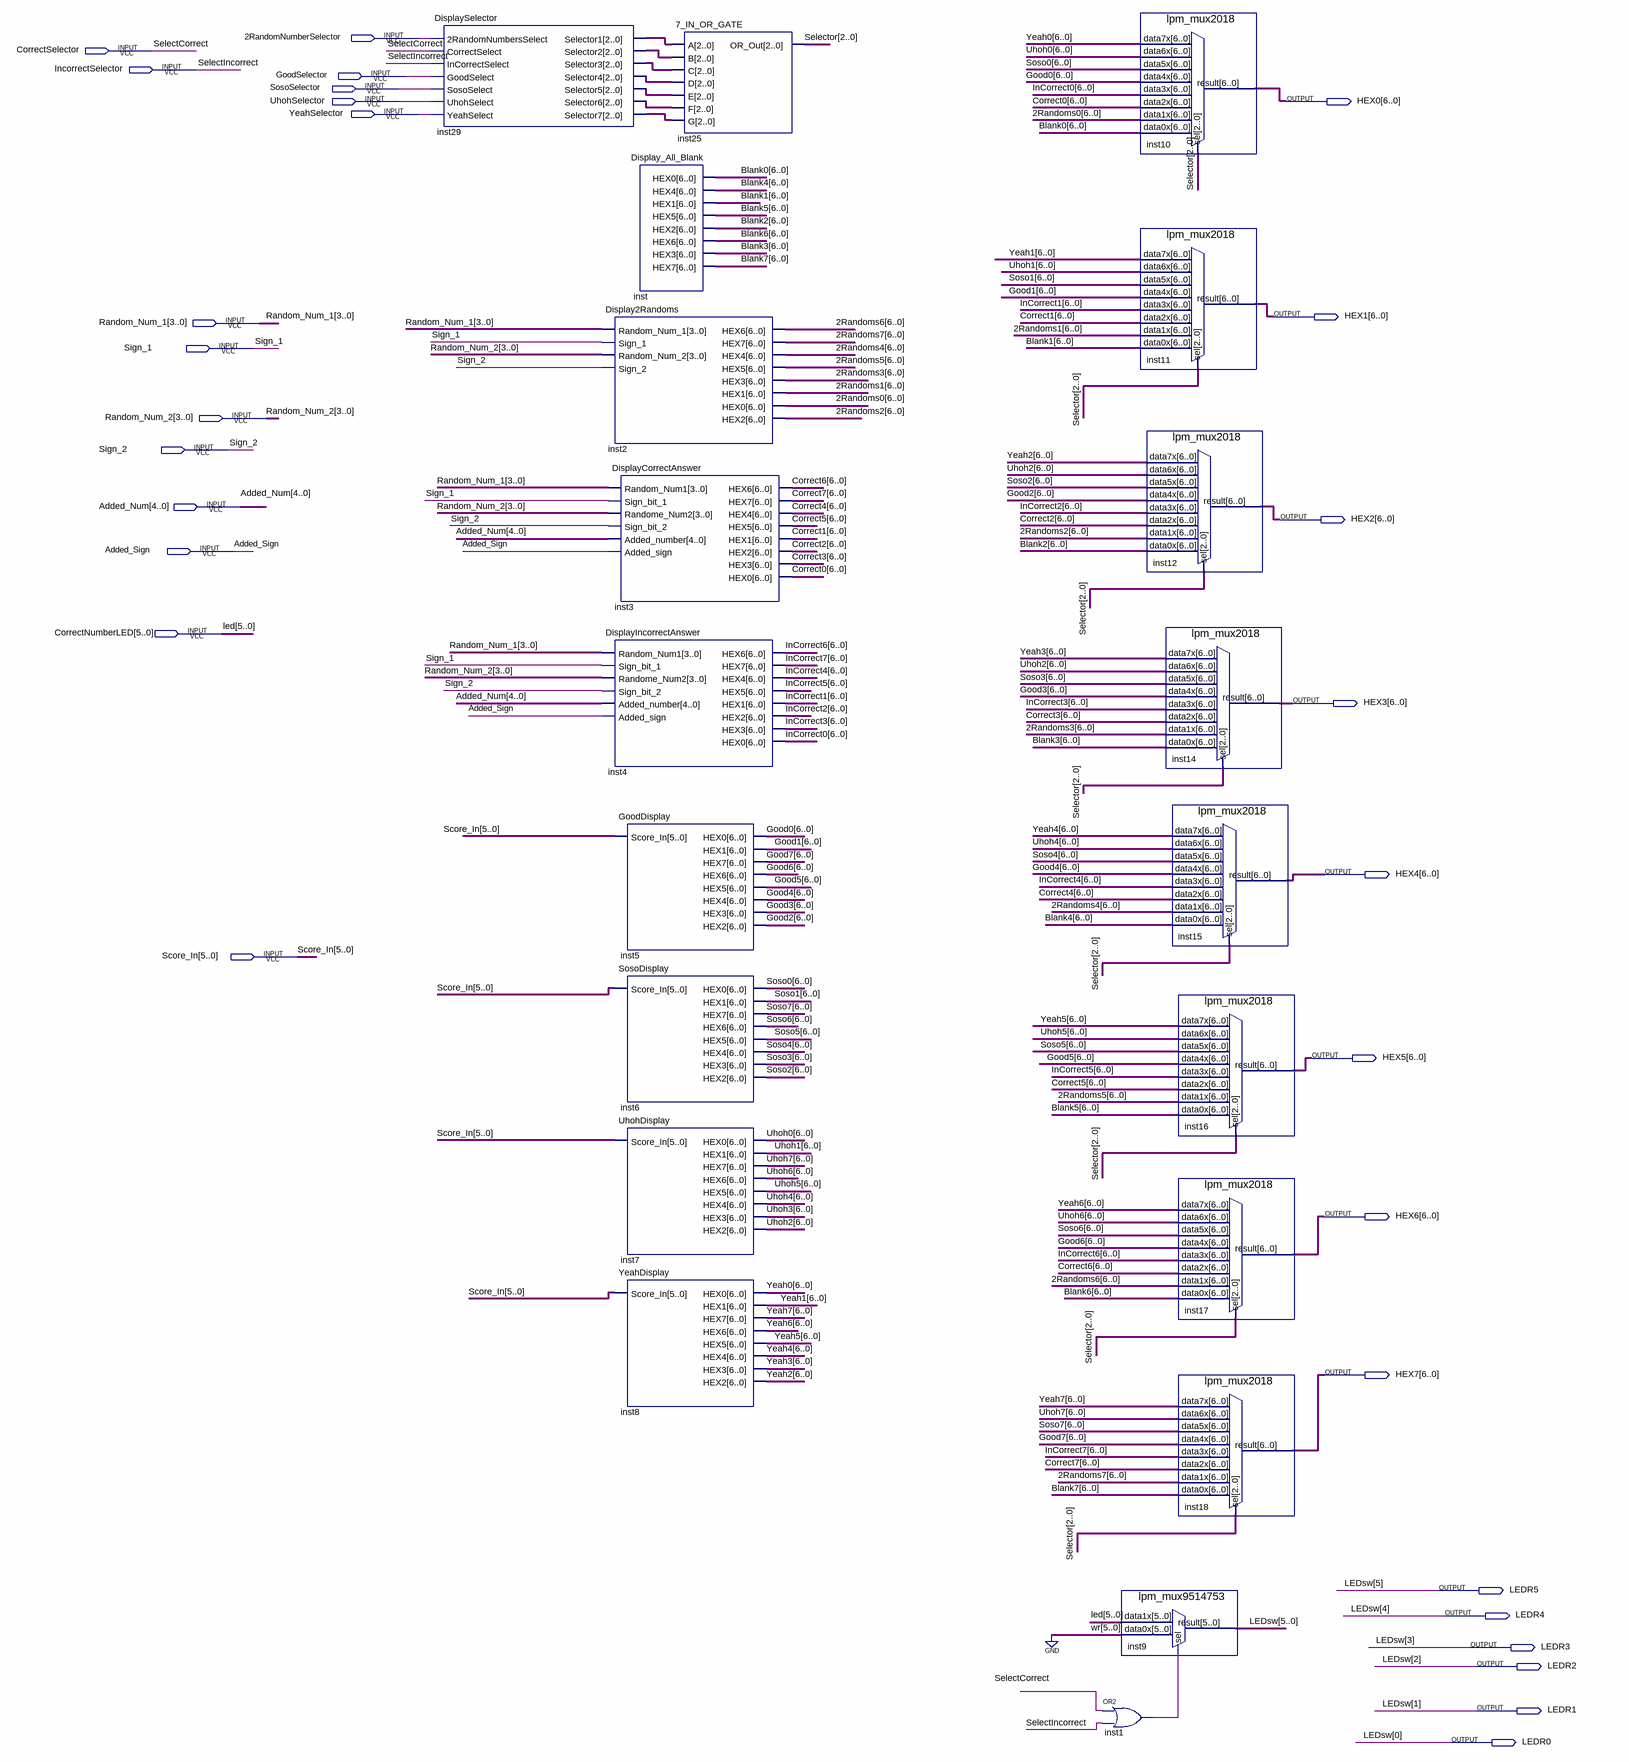
[diagram p0: schematic sheet]
// Quartus schematic DisplayControlUnit.bdf as structural Verilog: 20 symbols, 29 pins
module DisplayControlUnit (
  input  \2RandomNumberSelector ,
  input  CorrectSelector,
  input  IncorrectSelector,
  input  GoodSelector,
  input  SosoSelector,
  input  UhohSelector,
  input  YeahSelector,
  input  [3:0] Random_Num_1,
  input  Sign_1,
  input  [3:0] Random_Num_2,
  input  Sign_2,
  input  [4:0] Added_Num,
  input  Added_Sign,
  input  [5:0] CorrectNumberLED,
  input  [5:0] Score_In,
  output [6:0] HEX0,
  output [6:0] HEX1,
  output [6:0] HEX2,
  output [6:0] HEX3,
  output [6:0] HEX4,
  output [6:0] HEX5,
  output [6:0] HEX6,
  output [6:0] HEX7,
  output LEDR5,
  output LEDR4,
  output LEDR3,
  output LEDR2,
  output LEDR1,
  output LEDR0
);

  wire inst1_out;
  wire [2:0] inst29_selector1, inst29_selector2, inst29_selector3, inst29_selector4, inst29_selector5,
       inst29_selector6, inst29_selector7, Selector;
  wire [6:0] \2Randoms0 , \2Randoms1 , \2Randoms2 , \2Randoms3 , \2Randoms4 , \2Randoms5 , \2Randoms6 ,
       \2Randoms7 , Blank0, Blank1, Blank2, Blank3, Blank4, Blank5, Blank6, Blank7, Correct0, Correct1,
       Correct2, Correct3, Correct4, Correct5, Correct6, Correct7, Good0, Good1, Good2, Good3, Good4, Good5,
       Good6, Good7, InCorrect0, InCorrect1, InCorrect2, InCorrect3, InCorrect4, InCorrect5, InCorrect6,
       InCorrect7, Soso0, Soso1, Soso2, Soso3, Soso4, Soso5, Soso6, Soso7, Uhoh0, Uhoh1, Uhoh2, Uhoh3, Uhoh4,
       Uhoh5, Uhoh6, Uhoh7, Yeah0, Yeah1, Yeah2, Yeah3, Yeah4, Yeah5, Yeah6, Yeah7;

  DisplaySelector inst29 (
    .\2RandomNumbersSelect (\2RandomNumberSelector ), .CorrectSelect(CorrectSelector),
    .InCorrectSelect(IncorrectSelector), .GoodSelect(GoodSelector), .SosoSelect(SosoSelector),
    .UhohSelect(UhohSelector), .YeahSelect(YeahSelector), .Selector1(inst29_selector1),
    .Selector2(inst29_selector2), .Selector3(inst29_selector3), .Selector4(inst29_selector4),
    .Selector5(inst29_selector5), .Selector6(inst29_selector6), .Selector7(inst29_selector7));
  Display_All_Blank inst (
    .HEX0(Blank0), .HEX4(Blank4), .HEX1(Blank1), .HEX5(Blank5), .HEX2(Blank2), .HEX6(Blank6), .HEX3(Blank3),
    .HEX7(Blank7));
  Display2Randoms inst2 (
    .Random_Num_1(Random_Num_1), .Sign_1(Sign_1), .Random_Num_2(Random_Num_2), .Sign_2(Sign_2),
    .HEX6(\2Randoms6 ), .HEX7(\2Randoms7 ), .HEX4(\2Randoms4 ), .HEX5(\2Randoms5 ), .HEX3(\2Randoms3 ),
    .HEX1(\2Randoms1 ), .HEX0(\2Randoms0 ), .HEX2(\2Randoms2 ));
  DisplayCorrectAnswer inst3 (
    .Random_Num1(Random_Num_1), .Sign_bit_1(Sign_1), .Randome_Num2(Random_Num_2), .Sign_bit_2(Sign_2),
    .Added_number(Added_Num), .Added_sign(Added_Sign), .HEX6(Correct6), .HEX7(Correct7), .HEX4(Correct4),
    .HEX5(Correct5), .HEX1(Correct1), .HEX2(Correct2), .HEX3(Correct3), .HEX0(Correct0));
  DisplayIncorrectAnswer inst4 (
    .Random_Num1(Random_Num_1), .Sign_bit_1(Sign_1), .Randome_Num2(Random_Num_2), .Sign_bit_2(Sign_2),
    .Added_number(Added_Num), .Added_sign(Added_Sign), .HEX6(InCorrect6), .HEX7(InCorrect7),
    .HEX4(InCorrect4), .HEX5(InCorrect5), .HEX1(InCorrect1), .HEX2(InCorrect2), .HEX3(InCorrect3),
    .HEX0(InCorrect0));
  GoodDisplay inst5 (
    .Score_In(Score_In), .HEX0(Good0), .HEX1(Good1), .HEX7(Good7), .HEX6(Good6), .HEX5(Good5), .HEX4(Good4),
    .HEX3(Good3), .HEX2(Good2));
  SosoDisplay inst6 (
    .Score_In(Score_In), .HEX0(Soso0), .HEX1(Soso1), .HEX7(Soso7), .HEX6(Soso6), .HEX5(Soso5), .HEX4(Soso4),
    .HEX3(Soso3), .HEX2(Soso2));
  UhohDisplay inst7 (
    .Score_In(Score_In), .HEX0(Uhoh0), .HEX1(Uhoh1), .HEX7(Uhoh7), .HEX6(Uhoh6), .HEX5(Uhoh5), .HEX4(Uhoh4),
    .HEX3(Uhoh3), .HEX2(Uhoh2));
  YeahDisplay inst8 (
    .Score_In(Score_In), .HEX0(Yeah0), .HEX1(Yeah1), .HEX7(Yeah7), .HEX6(Yeah6), .HEX5(Yeah5), .HEX4(Yeah4),
    .HEX3(Yeah3), .HEX2(Yeah2));
  \7_IN_OR_GATE  inst25 (
    .A(inst29_selector1), .B(inst29_selector2), .C(inst29_selector3), .D(inst29_selector4),
    .E(inst29_selector5), .F(inst29_selector6), .G(inst29_selector7), .OR_Out(Selector));
  or inst1 (inst1_out, CorrectSelector, IncorrectSelector);
  lpm_mux2018 inst10 (
    .data7x(Yeah0), .data6x(Uhoh0), .data5x(Soso0), .data4x(Good0), .data3x(InCorrect0), .data2x(Correct0),
    .data1x(\2Randoms0 ), .data0x(Blank0), .sel(Selector), .result(HEX0));
  lpm_mux2018 inst11 (
    .data7x(Yeah1), .data6x(Uhoh1), .data5x(Soso1), .data4x(Good1), .data3x(InCorrect1), .data2x(Correct1),
    .data1x(\2Randoms1 ), .data0x(Blank1), .sel(Selector), .result(HEX1));
  lpm_mux2018 inst12 (
    .data7x(Yeah2), .data6x(Uhoh2), .data5x(Soso2), .data4x(Good2), .data3x(InCorrect2), .data2x(Correct2),
    .data1x(\2Randoms2 ), .data0x(Blank2), .sel(Selector), .result(HEX2));
  lpm_mux9514753 inst9 (
    .data1x(CorrectNumberLED), .data0x({6{1'b0}}), .sel(inst1_out),
    .result({LEDR5, LEDR4, LEDR3, LEDR2, LEDR1, LEDR0}));
  lpm_mux2018 inst14 (
    .data7x(Yeah3), .data6x(Uhoh2), .data5x(Soso3), .data4x(Good3), .data3x(InCorrect3), .data2x(Correct3),
    .data1x(\2Randoms3 ), .data0x(Blank3), .sel(Selector), .result(HEX3));
  lpm_mux2018 inst15 (
    .data7x(Yeah4), .data6x(Uhoh4), .data5x(Soso4), .data4x(Good4), .data3x(InCorrect4), .data2x(Correct4),
    .data1x(\2Randoms4 ), .data0x(Blank4), .sel(Selector), .result(HEX4));
  lpm_mux2018 inst16 (
    .data7x(Yeah5), .data6x(Uhoh5), .data5x(Soso5), .data4x(Good5), .data3x(InCorrect5), .data2x(Correct5),
    .data1x(\2Randoms5 ), .data0x(Blank5), .sel(Selector), .result(HEX5));
  lpm_mux2018 inst17 (
    .data7x(Yeah6), .data6x(Uhoh6), .data5x(Soso6), .data4x(Good6), .data3x(InCorrect6), .data2x(Correct6),
    .data1x(\2Randoms6 ), .data0x(Blank6), .sel(Selector), .result(HEX6));
  lpm_mux2018 inst18 (
    .data7x(Yeah7), .data6x(Uhoh7), .data5x(Soso7), .data4x(Good7), .data3x(InCorrect7), .data2x(Correct7),
    .data1x(\2Randoms7 ), .data0x(Blank7), .sel(Selector), .result(HEX7));

  // Other names for the same wires on the sheet: led[5:0] = CorrectNumberLED;
  //   LEDsw[5:0] = {LEDR5, LEDR4, LEDR3, LEDR2, LEDR1, LEDR0}; SelectCorrect = CorrectSelector;
  //   SelectIncorrect = IncorrectSelector
endmodule
